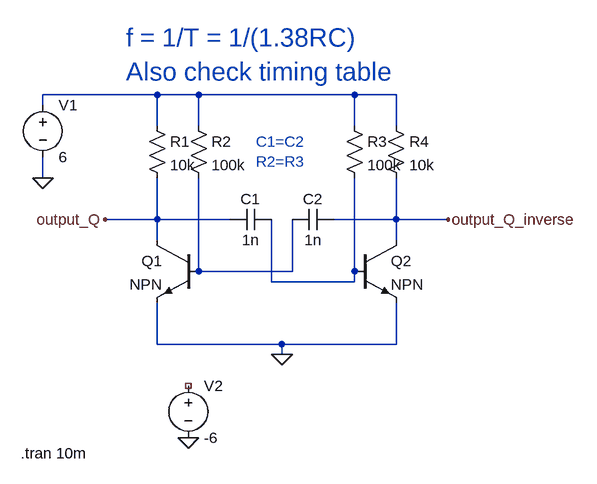
[diagram p0: schematic vib1.asc]
vib1.asc, the LTspice schematic file:
Version 4
SHEET 1 1008 680
WIRE 96 -64 -80 -64
WIRE 160 -64 96 -64
WIRE 400 -64 160 -64
WIRE 464 -64 400 -64
WIRE -80 -48 -80 -64
WIRE 96 -16 96 -64
WIRE 160 -16 160 -64
WIRE 400 -16 400 -64
WIRE 464 -16 464 -64
WIRE -80 64 -80 32
WIRE 96 128 96 64
WIRE 96 128 16 128
WIRE 208 128 96 128
WIRE 464 128 464 64
WIRE 464 128 368 128
WIRE 544 128 464 128
WIRE 96 160 96 128
WIRE 464 160 464 128
WIRE 160 208 160 64
WIRE 304 208 304 128
WIRE 304 208 160 208
WIRE 400 208 400 64
WIRE 272 224 272 128
WIRE 400 224 400 208
WIRE 400 224 272 224
WIRE 96 320 96 256
WIRE 288 320 96 320
WIRE 464 320 464 256
WIRE 464 320 288 320
WIRE 288 336 288 320
FLAG 16 128 output_Q
FLAG 544 128 output_Q_inverse
FLAG -80 64 0
FLAG 144 464 0
FLAG 288 336 0
SYMBOL npn 160 160 M0
SYMATTR InstName Q1
SYMBOL npn 400 160 R0
SYMATTR InstName Q2
SYMBOL voltage -80 -64 R0
WINDOW 123 0 0 Left 0
WINDOW 39 0 0 Left 0
SYMATTR InstName V1
SYMATTR Value 6
SYMBOL res 80 -32 R0
SYMATTR InstName R1
SYMATTR Value 10k
SYMBOL res 144 -32 R0
SYMATTR InstName R2
SYMATTR Value 100k
SYMBOL res 384 -32 R0
SYMATTR InstName R3
SYMATTR Value 100k
SYMBOL res 448 -32 R0
SYMATTR InstName R4
SYMATTR Value 10k
SYMBOL cap 272 112 R90
WINDOW 0 0 32 VBottom 2
WINDOW 3 32 32 VTop 2
SYMATTR InstName C1
SYMATTR Value 1n
SYMBOL cap 368 112 R90
WINDOW 0 0 32 VBottom 2
WINDOW 3 32 32 VTop 2
SYMATTR InstName C2
SYMATTR Value 1n
SYMBOL voltage 144 368 R0
WINDOW 123 0 0 Left 0
WINDOW 39 0 0 Left 0
SYMATTR InstName V2
SYMATTR Value -6
TEXT 248 8 Left 2 ;C1=C2\nR2=R3
TEXT 48 -152 Left 4 ;f = 1/T = 1/(1.38RC)\nAlso check timing table
TEXT -114 488 Left 2 !.tran 10m

The netlist it stands for:
* vib1.asc
Q1 output_Q N002 0 0 NPN
Q2 output_Q_inverse N003 0 0 NPN
V1 N001 0 6
R1 N001 output_Q 10k
R2 N001 N002 100k
R3 N001 N003 100k
R4 N001 output_Q_inverse 10k
C1 N003 output_Q 1n
C2 output_Q_inverse N002 1n
V2 NC_01 0 -6
.model NPN NPN
.model PNP PNP
.lib standard.bjt
* C1=C2
* R2=R3
* f = 1/T = 1/(1.38RC)
* Also check timing table
.tran 10m
.backanno
.end